# EasyEDA schematic SCH_LED bar_2021-10-13.json
TITLE: Sheet_1; REV: 1.0; Date: 2021-10-10; Sheet: 1/1; Drawn By: limchengwei; Company: Your Company
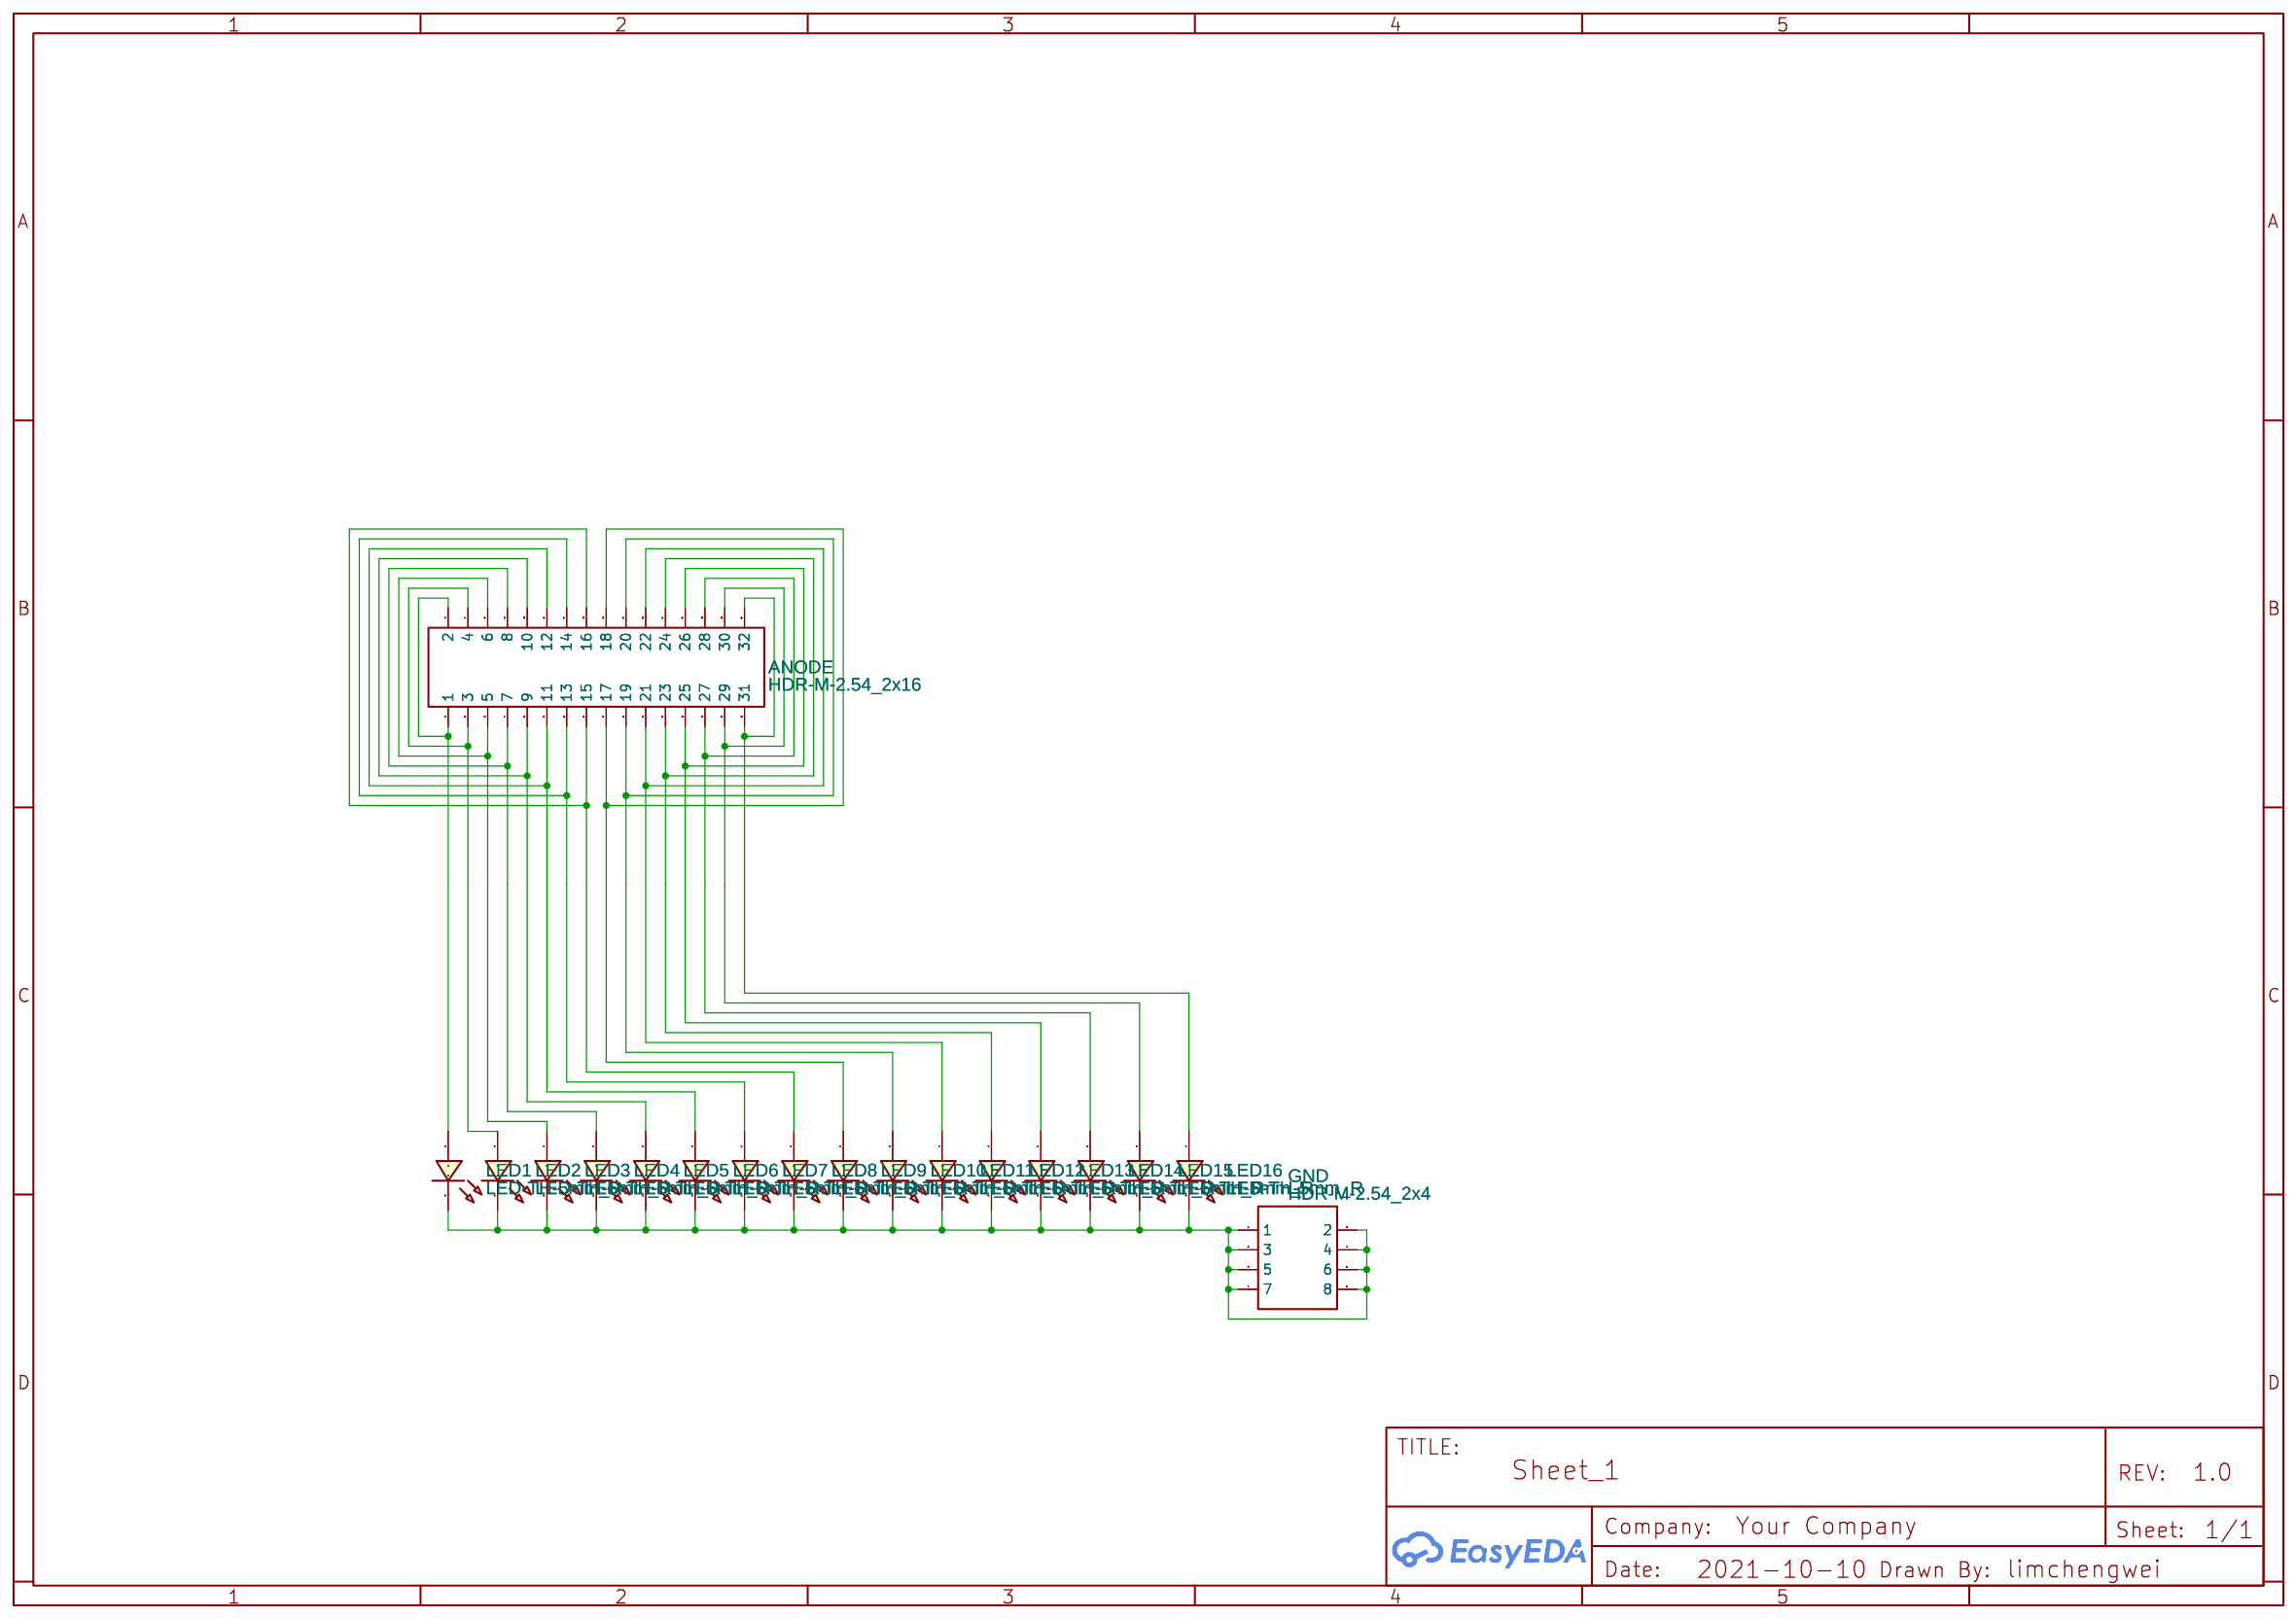
[diagram p0: schematic sheet]

## Parts
ANODE  HDR-M-2.54_2x16  [HDR-M-2.54_2X16]
GND  HDR-M-2.54_2x4  [HDR-M-2.54_2X4]
LED1  LED-TH-5mm_R  [LED-TH_BD5.0_RED]
LED2  LED-TH-5mm_R  [LED-TH_BD5.0_RED]
LED3  LED-TH-5mm_R  [LED-TH_BD5.0_RED]
LED4  LED-TH-5mm_R  [LED-TH_BD5.0_RED]
LED5  LED-TH-5mm_R  [LED-TH_BD5.0_RED]
LED6  LED-TH-5mm_R  [LED-TH_BD5.0_RED]
LED7  LED-TH-5mm_R  [LED-TH_BD5.0_RED]
LED8  LED-TH-5mm_R  [LED-TH_BD5.0_RED]
LED9  LED-TH-5mm_R  [LED-TH_BD5.0_RED]
LED10  LED-TH-5mm_R  [LED-TH_BD5.0_RED]
LED11  LED-TH-5mm_R  [LED-TH_BD5.0_RED]
LED12  LED-TH-5mm_R  [LED-TH_BD5.0_RED]
LED13  LED-TH-5mm_R  [LED-TH_BD5.0_RED]
LED14  LED-TH-5mm_R  [LED-TH_BD5.0_RED]
LED15  LED-TH-5mm_R  [LED-TH_BD5.0_RED]
LED16  LED-TH-5mm_R  [LED-TH_BD5.0_RED]

## Library data of the parts
ANODE = HDR-M-2.54_2x16: Supplier Part: C124382; Supplier: LCSC; Contributor: LCEDA_Lib
GND = HDR-M-2.54_2x4: Supplier Part: C58363; Supplier: LCSC; Contributor: LCEDA_Lib
LED1-LED16 = LED-TH-5mm_R: Manufacturer: EVERLIGHT(台湾亿光); Manufacturer Part: 333-2SURD/S530-A3; Supplier Part: C87271; Supplier: LCSC; Contributor: LCEDA_Lib

## Nets
Net-(ANODE-1): ANODE.1 ANODE.2 LED1.1
Net-(ANODE-3): ANODE.3 ANODE.4 LED2.1
Net-(ANODE-5): ANODE.5 ANODE.6 LED3.1
Net-(ANODE-7): ANODE.7 ANODE.8 LED4.1
Net-(ANODE-9): ANODE.9 ANODE.10 LED5.1
Net-(ANODE-11): ANODE.11 ANODE.12 LED6.1
Net-(ANODE-13): ANODE.13 ANODE.14 LED7.1
Net-(ANODE-15): ANODE.15 ANODE.16 LED8.1
Net-(ANODE-17): ANODE.17 ANODE.18 LED9.1
Net-(ANODE-19): ANODE.19 ANODE.20 LED10.1
Net-(ANODE-21): ANODE.21 ANODE.22 LED11.1
Net-(ANODE-23): ANODE.23 ANODE.24 LED12.1
Net-(ANODE-25): ANODE.25 ANODE.26 LED13.1
Net-(ANODE-27): ANODE.27 ANODE.28 LED14.1
Net-(ANODE-29): ANODE.29 ANODE.30 LED15.1
Net-(ANODE-31): ANODE.31 ANODE.32 LED16.1
Net-(GND-1): GND.1 GND.2 GND.3 GND.4 GND.5 GND.6 GND.7 GND.8 LED1.2 LED2.2 LED3.2 LED4.2 LED5.2 LED6.2 LED7.2 LED8.2 LED9.2 LED10.2 LED11.2 LED12.2 LED13.2 LED14.2 LED15.2 LED16.2
